# Altium schematic sheet board_supplies.SchDoc
size B
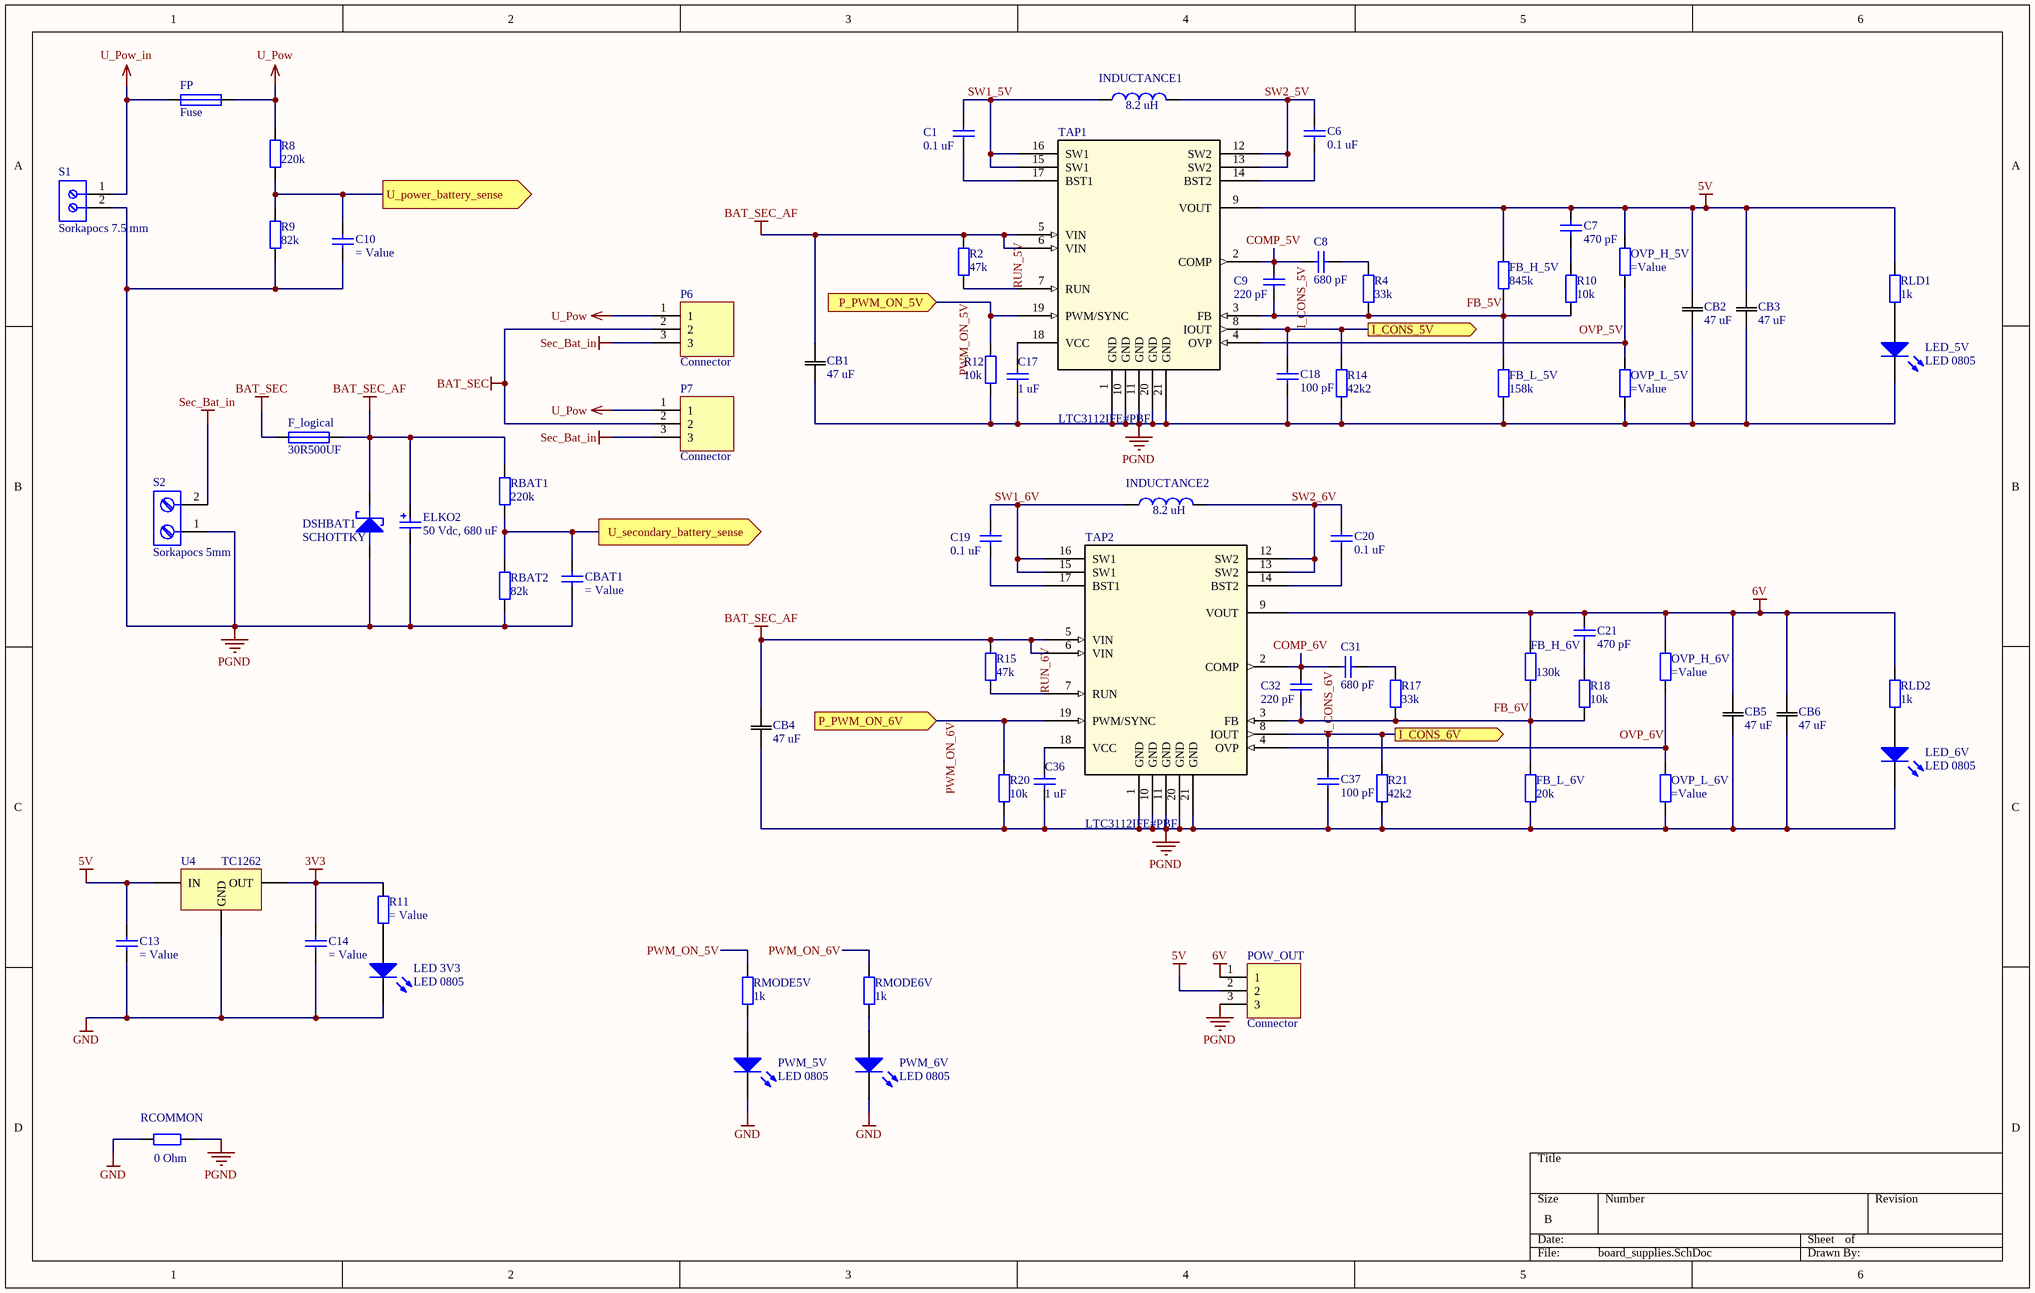
[diagram p0: board_supplies.SchDoc]

## Parts
C1  0.1 uF  [0805_C]
C6  0.1 uF  [0805_C]
C7  470 pF  [0805_C]
C8  680 pF  [0805_C]
C9  220 pF  [0805_C]
C10  (no value)  [0805_C]
C13  (no value)  [0805_C]
C14  (no value)  [0805_C]
C17  1 uF  [0805_C]
C18  100 pF  [0805_C]
C19  0.1 uF  [0805_C]
C20  0.1 uF  [0805_C]
C21  470 pF  [0805_C]
C31  680 pF  [0805_C]
C32  220 pF  [0805_C]
C36  1 uF  [0805_C]
C37  100 pF  [0805_C]
CB1  47 uF  [CAP_5750]
CB2  47 uF  [CAP_5750]
CB3  47 uF  [CAP_5750]
CB4  47 uF  [CAP_5750]
CB5  47 uF  [CAP_5750]
CB6  47 uF  [CAP_5750]
CBAT1  (no value)  [0805_C]
DSHBAT1  SCHOTTKY  [FP_SMB]
ELKO2  50 Vdc, 680 uF  [WCAP-ATG8_13x20x5]
F_logical  30R500UF  [Polyfuse THT]
FB_H_5V  845k  [0805_R]
FB_H_6V  130k  [0805_R]
FB_L_5V  158k  [0805_R]
FB_L_6V  20k  [0805_R]
FP  Fuse  [Fuse ATO]
INDUCTANCE1  8.2 uH  [MSS148 SMD INDUCTOR]
INDUCTANCE2  8.2 uH  [MSS148 SMD INDUCTOR]
LED_3V3  LED 0805  [0805_LED_G]
LED_5V  LED 0805  [0805_LED_G]
LED_6V  LED 0805  [0805_LED_G]
OVP_H_5V  (no value)  [0805_R]
OVP_H_6V  (no value)  [0805_R]
OVP_L_5V  (no value)  [0805_R]
OVP_L_6V  (no value)  [0805_R]
P6  Connector  [FP_CONN3_TUSKE_254MM]
P7  Connector  [FP_CONN3_TUSKE_254MM]
POW_OUT  Connector  [FP_CONN3_TAP_254MM]
PWM_5V  LED 0805  [0805_LED_R]
PWM_6V  LED 0805  [0805_LED_R]
R2  47k  [0805_R]
R4  33k  [0805_R]
R8  220k  [0805_R]
R9  82k  [0805_R]
R10  10k  [0805_R]
R11  (no value)  [0805_R]
R12  10k  [0805_R]
R14  42k2  [0805_R]
R15  47k  [0805_R]
R17  33k  [0805_R]
R18  10k  [0805_R]
R20  10k  [0805_R]
R21  42k2  [0805_R]
RBAT1  220k  [0805_R]
RBAT2  82k  [0805_R]
RCOMMON  0 Ohm  [0805_R]
RLD1  1k  [0805_R]
RLD2  1k  [0805_R]
RMODE5V  1k  [0805_R]
RMODE6V  1k  [0805_R]
S1  Sorkapocs 7.5 mm  [Sorkapocs 7.5mm]
S2  Sorkapocs 5mm  [Sorkapocs 5mm]
TAP1  LTC3112IFE#PBF  [TSSOP-20_FE/CA]
TAP2  LTC3112IFE#PBF  [TSSOP-20_FE/CA]
U4  TC1262  [FP_SOT223]

## Ports
I_CONS_5V (out), I_CONS_6V (out), P_PWM_ON_5V (in), P_PWM_ON_6V (in), U_power_battery_sense (out), U_secondary_battery_sense (out)

## Nets
3V3: C14.1 R11.2 U4.3(OUT)
5V: C7.1 C13.1 CB2.2 CB3.2 FB_H_5V.2 OVP_H_5V.2 POW_OUT.2 RLD1.1 TAP1.9(VOUT) U4.1(IN)
6V: C21.1 CB5.2 CB6.2 FB_H_6V.2 OVP_H_6V.2 POW_OUT.1 RLD2.1 TAP2.9(VOUT)
BAT_SEC: F_logical.1 P6.2 P7.2
BAT_SEC_AF: CB1.2 CB4.2 DSHBAT1.1(CATHODE) ELKO2.1(P) F_logical.2 R2.2 R15.2 RBAT1.2 TAP1.5(VIN) TAP1.6(VIN) TAP2.5(VIN) TAP2.6(VIN)
GND: C13.2 C14.2 LED_3V3.2(K) PWM_5V.2(K) PWM_6V.2(K) RCOMMON.2 U4.2(GND)
PGND: C10.2 C17.2 C18.2 C36.2 C37.2 CB1.1 CB2.1 CB3.1 CB4.1 CB5.1 CB6.1 CBAT1.2 DSHBAT1.2(ANODE) ELKO2.2(N) FB_L_5V.1 FB_L_6V.1 LED_5V.2(K) LED_6V.2(K) OVP_L_5V.1 OVP_L_6V.1 POW_OUT.3 R9.1 R12.1 R14.1 R20.1 R21.1 RBAT2.1 RCOMMON.1 S1.2 S2.1 TAP1.1(GND) TAP1.10(GND) TAP1.11(GND) TAP1.20(GND) TAP1.21(GND) TAP2.1(GND) TAP2.10(GND) TAP2.11(GND) TAP2.20(GND) TAP2.21(GND)
Sec_Bat_in: P6.3 P7.3 S2.2
U_Pow: FP.2 P6.1 P7.1 R8.2
U_Pow_in: FP.1 S1.1
COMP_5V: C8.1 C9.1 TAP1.2(COMP)
COMP_6V: C31.1 C32.1 TAP2.2(COMP)
FB_5V: C9.2 FB_H_5V.1 FB_L_5V.2 R4.1 R10.2 TAP1.3(FB)
FB_6V: C32.2 FB_H_6V.1 FB_L_6V.2 R17.1 R18.2 TAP2.3(FB)
I_CONS_5V: C18.1 R14.2 TAP1.8(IOUT) ; port I_CONS_5V
I_CONS_6V: C37.1 R21.2 TAP2.8(IOUT) ; port I_CONS_6V
OVP_5V: OVP_H_5V.1 OVP_L_5V.2 TAP1.4(OVP)
OVP_6V: OVP_H_6V.1 OVP_L_6V.2 TAP2.4(OVP)
PWM_ON_5V: R12.2 RMODE5V.2 TAP1.19(PWM/SYNC) ; port P_PWM_ON_5V
PWM_ON_6V: R20.2 RMODE6V.2 TAP2.19(PWM/SYNC) ; port P_PWM_ON_6V
RUN_5V: R2.1 TAP1.7(RUN)
RUN_6V: R15.1 TAP2.7(RUN)
SW1_5V: C1.1 INDUCTANCE1.1 TAP1.15(SW1) TAP1.16(SW1)
SW1_6V: C19.1 INDUCTANCE2.1 TAP2.15(SW1) TAP2.16(SW1)
SW2_5V: C6.1 INDUCTANCE1.2 TAP1.12(SW2) TAP1.13(SW2)
SW2_6V: C20.1 INDUCTANCE2.2 TAP2.12(SW2) TAP2.13(SW2)
U_power_battery_sense: C10.1 R8.1 R9.2 ; port U_power_battery_sense
U_secondary_battery_sense: CBAT1.1 RBAT1.1 RBAT2.2 ; port U_secondary_battery_sense
NetC1_2: C1.2 TAP1.17(BST1)
NetC6_2: C6.2 TAP1.14(BST2)
NetC7_2: C7.2 R10.1
NetC8_2: C8.2 R4.2
NetC17_1: C17.1 TAP1.18(VCC)
NetC19_2: C19.2 TAP2.17(BST1)
NetC20_2: C20.2 TAP2.14(BST2)
NetC21_2: C21.2 R18.1
NetC31_2: C31.2 R17.2
NetC36_1: C36.1 TAP2.18(VCC)
NetLED_3V3_1: LED_3V3.1(A) R11.1
NetLED_5V_1: LED_5V.1(A) RLD1.2
NetLED_6V_1: LED_6V.1(A) RLD2.2
NetPWM_5V_1: PWM_5V.1(A) RMODE5V.1
NetPWM_6V_1: PWM_6V.1(A) RMODE6V.1

## Library data of the parts
C1 C6-C10 C13 C14 C17-C21 C31 C32 C36 C37 CBAT1 = CAP 0805
CB1-CB6 = C5750X5R1C476M23: C5750X5R1C476M230KA -  SMD Multilayer Ceramic Capacitor, 2220 [5650 Metric], 47 µF, 16 V, ± 20%, X5R, C Series TDK; Built_By: EMA_UL_Team; C: Copyright (C) 2015 Accelerated Designs. All rights reserved; Vendor: TDK; Manufacturer_Part_Number: C5750X5R1C476M230KA; RefDes: RefDes; Type: DEV; Value: Value; ComponentLink1Description: Farnell.com; ComponentLink1URL: https://hu.farnell.com/tdk/c5750x5r1c476m230ka/cap-47-f-16v-20-x5r-2220/dp/2112739?st=TDK%20C5750X5
DSHBAT1 = SCHOTTKY: SS26T3G -  Schottky Rectifier, 60 V, 2 A, Single, DO-214AA, 2 Pins, 630 mV; ComponentLink1Description: Farnell.com; ComponentLink1URL: https://hu.farnell.com/on-semiconductor/ss26t3g/diode-schottky-2a-60v-do-214aa/dp/2317411
ELKO2 = ELKO 860010678022: WCAP-ATG8 Aluminum Electrolytic Capacitors, 13x20mm, 50 Vdc, 680 uF; Rated Voltage: 50 Vdc; Value: 680 uF; ComponentLink1Description: Manufacturer; ComponentLink1URL: http://www.we-online.de; ComponentLink2Description: Datasheet; ComponentLink2URL: http://katalog.we-online.de/pbs/datasheet/860010678022.pdf; Part Number: 860010678022; Published Date: Sep. 2017; Publisher: Wurth Elektronik; Size: 13x20mm; Life Cycle: 2000h; Operating Temperature: -40 °C up to +85 °C; ComponentLink3Description: FArnell.com; ComponentLink3URL: https://hu.farnell.com/wurth-elektronik/860010678022/cap-680-f-50v-20/dp/2465746
F_logical = Polyfuse THT: 30R500UF -  PPTC Resettable Fuse, Through Hole, POLYFUSE 30R Series, 5 A, 10 A, 30 VDC, -40 °C; ComponentLink1Description: Farmell.com; ComponentLink1URL: https://hu.farnell.com/littelfuse/30r500uf/polyfuse-ptc-radial-5a/dp/1822242?st=polifuse
FB_H_5V FB_H_6V FB_L_5V FB_L_6V OVP_H_5V OVP_H_6V OVP_L_5V OVP_L_6V R2 R4 R8-R12 R14 R15 R17 R18 R20 R21 RBAT1 RBAT2 RCOMMON RLD1 RLD2 RMODE5V RMODE6V = RES 0805
FP = Fuse: 178.6164.0001 -  Fuseholder, PCB Mount, 80V, 80A, ATO, Solder, Through Hole, Black; ComponentLink1Description: Farnell.com; ComponentLink1URL: https://hu.farnell.com/littelfuse/178-6164-0001/fuse-holder-80v-through-hole/dp/2762065
INDUCTANCE1 INDUCTANCE2 = MSS1048-822NLC: MSS1048-822NLC -  Power Inductor (SMD), 8.2 µH, 5.71 A, Shielded, 3.14 A, MSS1048 Series, 10.2mm x 10mm x 4.8mm; ComponentLink1Description: farnell.com; ComponentLink1URL: https://hu.farnell.com/coilcraft/mss1048-822nlc/inductor-8-2uh-5-71a-30-pwr-28mhz/dp/2288284?st=Coilcraft%20MSS1048
LED_3V3 LED_5V LED_6V PWM_5V PWM_6V = LED 0805: Aranyos világító ledecskék
P6 P7 POW_OUT = Connector_3pin: 3pin connector
S2 = Sorkapocs 5mm: Kicsi, aranyos, szeretnivaló, sorkapocs.; ComponentLink1Description: mouser.com; ComponentLink1URL: https://hu.mouser.com/ProductDetail/Wurth-Electronics/691137710002?qs=%2fha2pyFaduj3xlSbfy6%2fbc%252bPFskhWuVy5hJs1tDSLqudr8Dqqu65tg%3d%3d
TAP1 TAP2 = LTC3112IFE#PBF: LTC3112IFE#PBF -  DC-DC Switching Buck-Boost Regulator, Adjustable, 2.7V-15Vin, 2.5V-14Vout, 2.5Aout, TSSOP-20; Vendor: Linear Technology; Manufacturer_Part_Number: LTC3112IFE#PBF; RefDes: RefDes; Type: DEV; Value: Value; ComponentLink1Description: Farnell.com; ComponentLink1URL: https://hu.farnell.com/linear-technology/ltc3112ife-pbf/dc-dc-buck-boost-15v-2-5a-20tssop/dp/2295021
U4 = TC1262: TC1262-3.3VDB -  Fixed LDO Voltage Regulator, 2.7V to 6V, 350mV Dropout, 3.3Vout, 500mAout, SOT-223-3; ComponentLink1Description: Farnell.com; ComponentLink1URL: https://hu.farnell.com/microchip/tc1262-3-3vdb/ic-ldo-500ma-3-3v-sot223-3/dp/1852183?krypto=Z9yKr3sEev96lCFTtZI6KGaxPtnuQnb1T4ViDd%2FnyMNeEDWD2qqoEvziga%2F4xnVwdpU%2FoX3let48tbk1C5kMGRAfemZn0l3OMnA2xCXuAvPFaoGbxobFqaPxgX7JG6PeQ78hNVpwY%2BCYhCFWhpb6g9HxqnoSd3nd2AM8qXrIomxVX6c5locpZ86MKP6hCMhu&ddkey=https%3Ahu-HU%2FElement14_Hungary%2Fw%2Fsearch
S1 = Sorkapocs 7.5 mm: ComponentLink1Description: mouser.com; ComponentLink1URL: https://hu.mouser.com/ProductDetail/Phoenix-Contact/1988105?qs=sGAEpiMZZMvZTcaMAxB2ALNEUezFajW2H9fYPecO8pg%3d